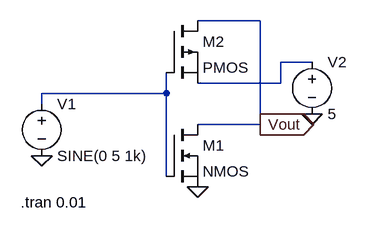
[diagram p0: schematic (8)inverter_using_CMOS[1].asc]
(8)inverter_using_CMOS[1].asc, the LTspice schematic file:
Version 4
SHEET 1 880 680
WIRE 400 64 304 64
WIRE 480 128 432 128
WIRE 432 160 432 128
WIRE 432 160 304 160
WIRE 256 176 256 144
WIRE 256 176 64 176
WIRE 64 192 64 176
WIRE 400 224 400 64
WIRE 400 224 304 224
WIRE 256 304 256 176
FLAG 64 272 0
FLAG 304 320 0
FLAG 480 208 0
FLAG 400 224 Vout
IOPIN 400 224 Out
SYMBOL nmos 256 224 R0
SYMATTR InstName M1
SYMBOL pmos 256 64 R0
SYMATTR InstName M2
SYMBOL voltage 64 176 R0
WINDOW 123 0 0 Left 0
WINDOW 39 0 0 Left 0
SYMATTR InstName V1
SYMATTR Value SINE(0 5 1k)
SYMBOL voltage 480 112 R0
WINDOW 123 0 0 Left 0
WINDOW 39 0 0 Left 0
SYMATTR InstName V2
SYMATTR Value 5
TEXT 32 344 Left 2 !.tran 0.01

The netlist it stands for:
* (8)inverter_using_CMOS[1].asc
M1 Vout N002 0 0 NMOS
M2 Vout N002 N001 N001 PMOS
V1 N002 0 SINE(0 5 1k)
V2 N001 0 5
.model NMOS NMOS
.model PMOS PMOS
.lib standard.mos
.tran 0.01
.backanno
.end